# EAGLE design Cursor-Internal (EAGLE 7.4.1)
Cursor Keypad Simple 5 Button cursor keys for use inside an ALPR EC60A/B encoder ring. The cursor keys sit on an board that has to be suspenden by an 3D Printed frame. 4 3.2mm mounting holes are for this.
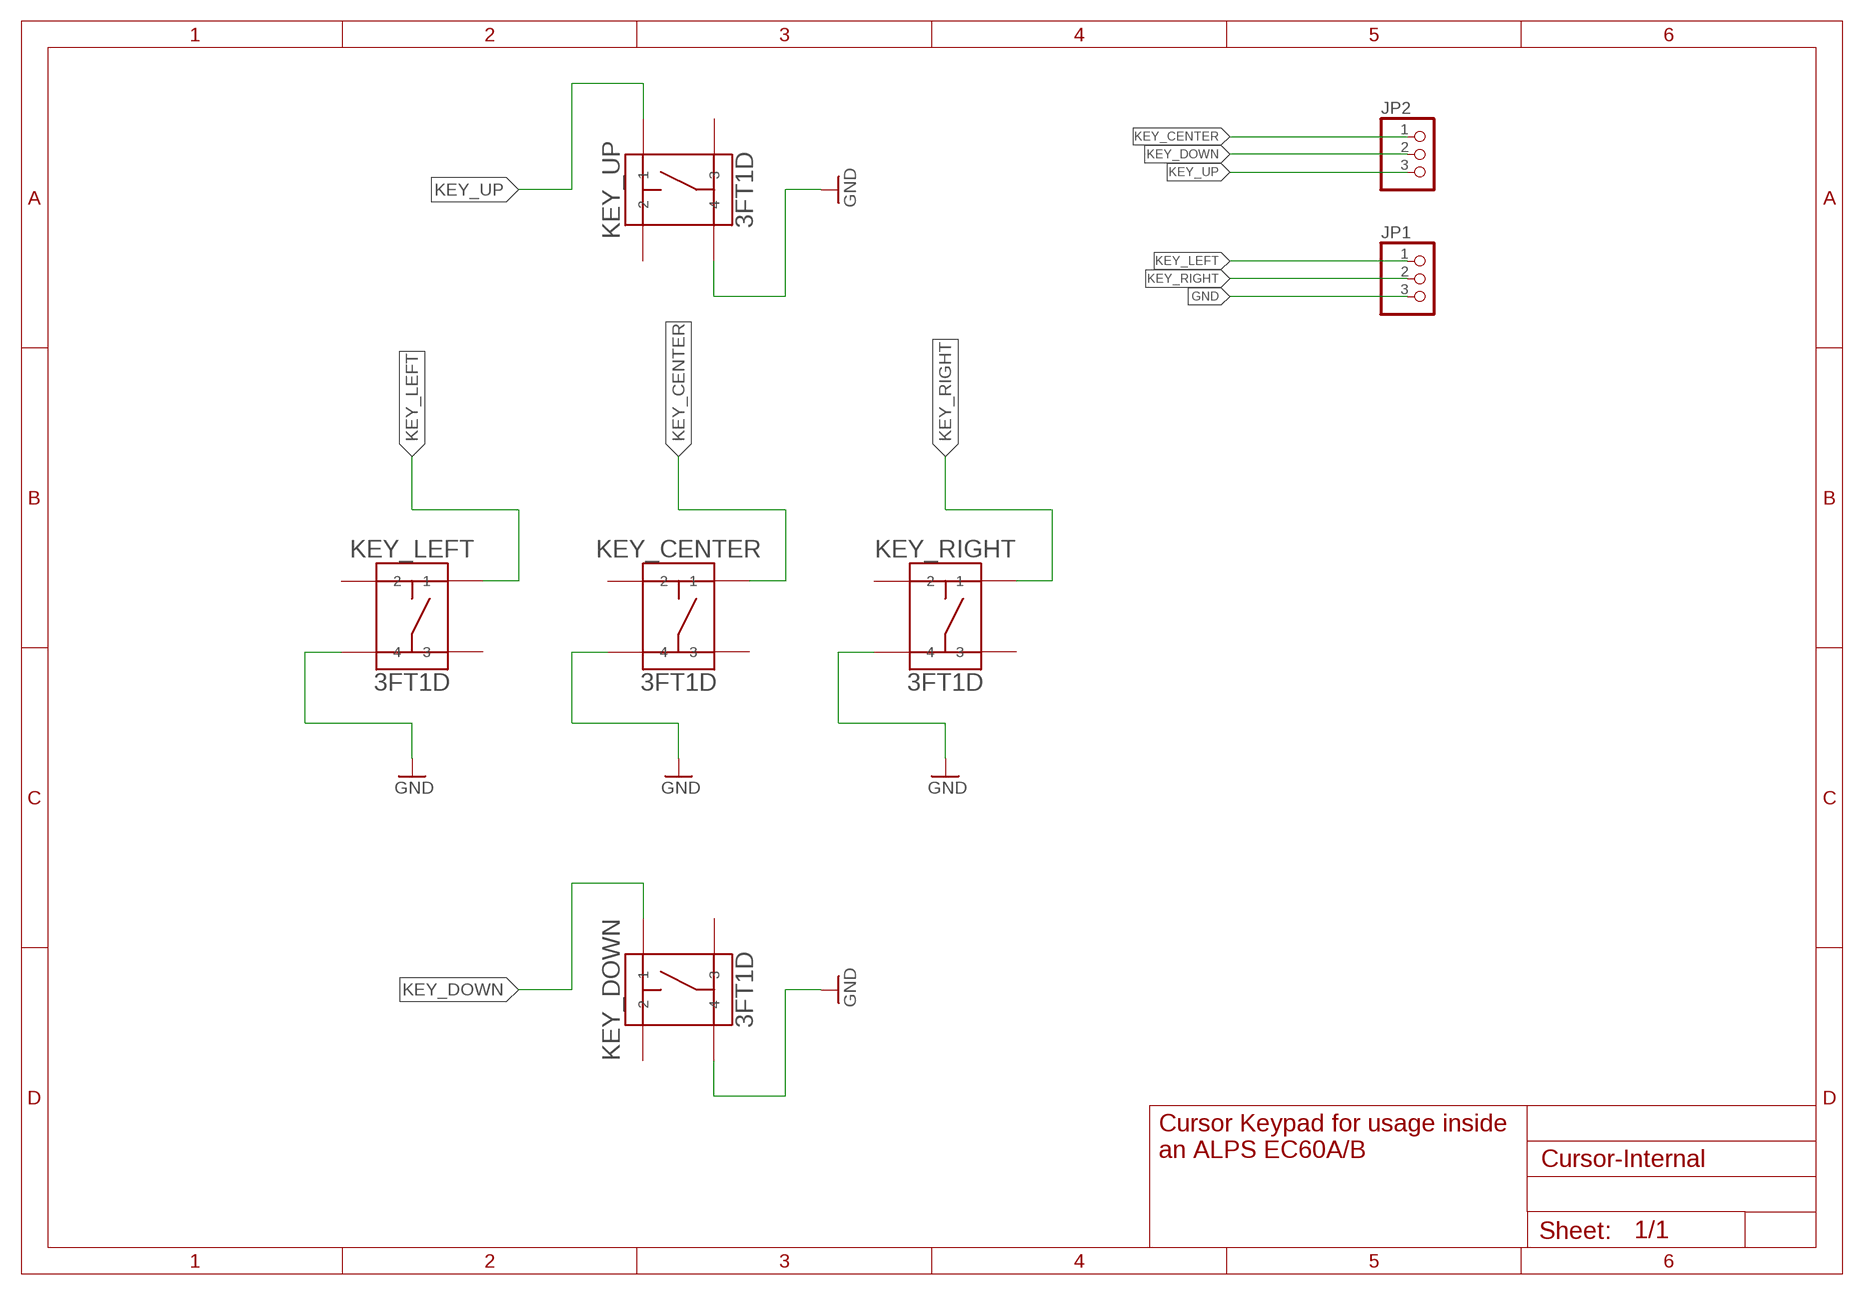
[diagram p0: schematic, sheet 1]

## Parts
JP1  PINHD-1X3  [1X03]
JP2  PINHD-1X3  [1X03]
KEY_CENTER  3FT1D  [3FT]
KEY_DOWN  3FT1D  [3FT]
KEY_LEFT  3FT1D  [3FT]
KEY_RIGHT  3FT1D  [3FT]
KEY_UP  3FT1D  [3FT]

## Nets
GND [Supply]: JP1.3 KEY_CENTER.P$4 KEY_DOWN.P$4 KEY_LEFT.P$4 KEY_RIGHT.P$4 KEY_UP.P$4
KEY_CENTER [Supply]: JP2.1 KEY_CENTER.P$1
KEY_DOWN [Supply]: JP2.2 KEY_DOWN.P$1
KEY_LEFT [Supply]: JP1.1 KEY_LEFT.P$1
KEY_RIGHT [Supply]: JP1.2 KEY_RIGHT.P$1
KEY_UP [Supply]: JP2.3 KEY_UP.P$1
Unconnected: KEY_CENTER.P$2 KEY_CENTER.P$3 KEY_DOWN.P$2 KEY_DOWN.P$3 KEY_LEFT.P$2 KEY_LEFT.P$3 KEY_RIGHT.P$2 KEY_RIGHT.P$3 KEY_UP.P$2 KEY_UP.P$3

## Notes on the sheet
- Cursor Keypad for usage inside
  an ALPS EC60A/B

## Library data of the parts
JP1 JP2 = pinhead:PINHD-1X3: PIN HEADER
KEY_CENTER KEY_DOWN KEY_LEFT KEY_RIGHT KEY_UP = mec switches:3FT1D: Mulitmec - 3FT1D <http://www.mec.dk/statisk.php4?id=504> Switch 3F - Through Hole with basic matt cover http://www.mec.dk

## Net classes
0 default: width 0.3 mm
1 Supply: width 0.762 mm

## Board
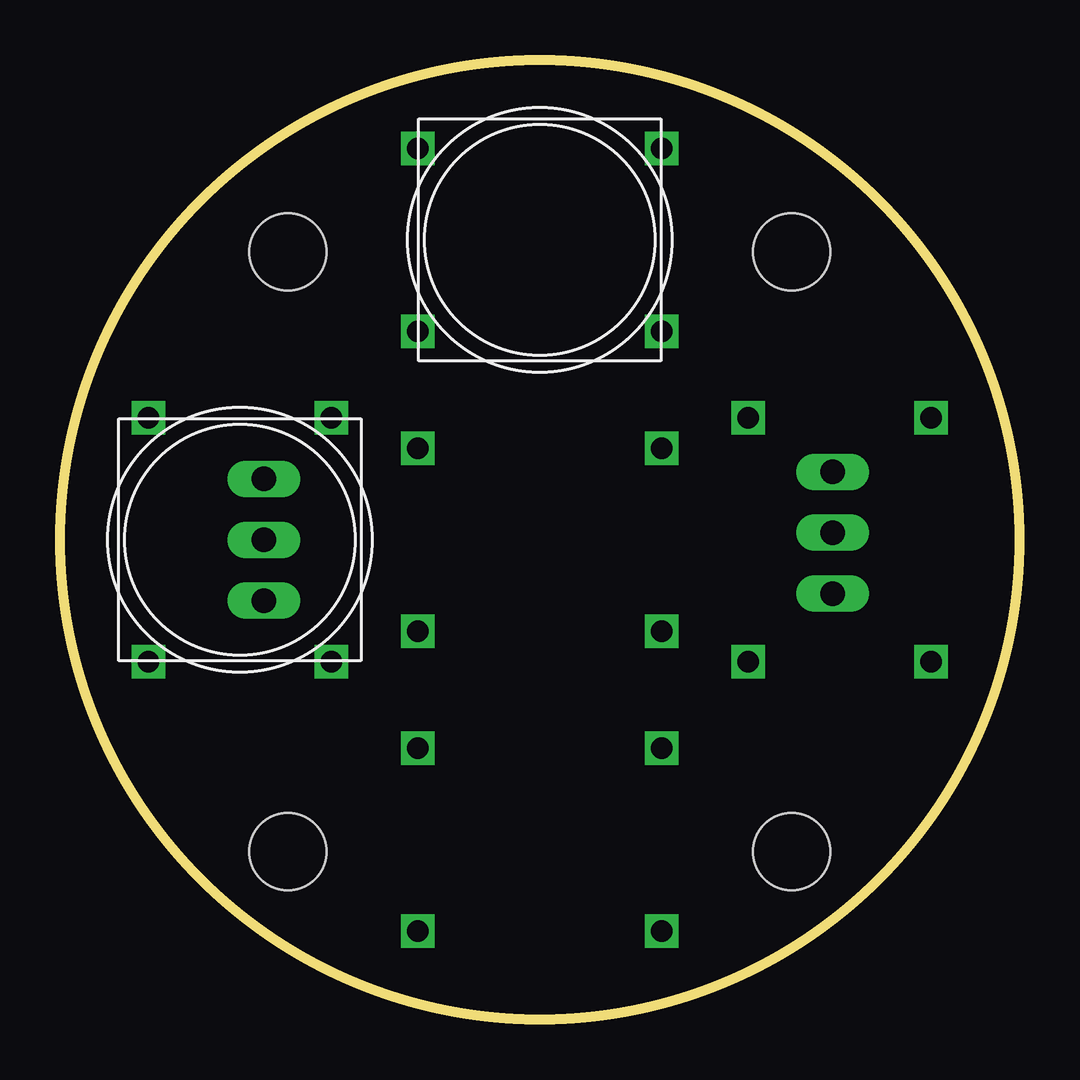
[diagram p1: board, top side]
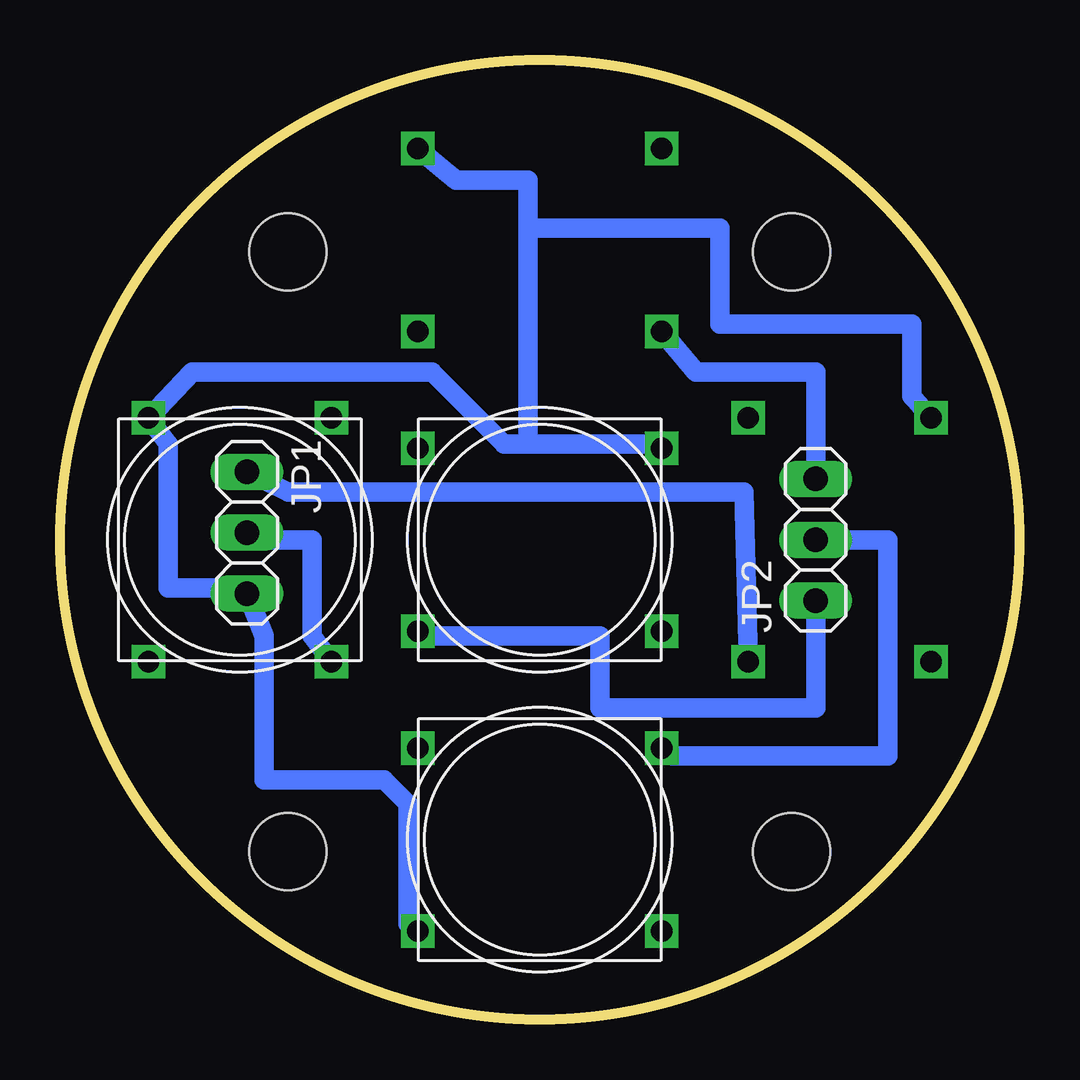
[diagram p2: board, bottom side, seen from below]

Size 40 x 40 mm. Coordinates in mm from the lower left corner, seen from the top.
Outline: circle at 20,20 radius 20
Copper layers (1*16): Top 0.035mm / dielectric 1.5mm / Bottom 0.035mm
Design rules "default": minimum track width 10mil, minimum drill 24mil, track to track 8mil, track to pad 8mil, pad to pad 8mil, via to via 8mil, smd to smd 8mil, copper to edge 40mil, drill to drill 8mil, minimum pad ring 10mil, minimum via ring 8mil, stop-mask expansion 4mil, vias tented up to drill 0mil, thermal gap 10mil
Holes 3.2 mm at 9.5,32 30.5,7 30.5,32 9.5,7

### Footprints (pad centres in the part's own frame; a part is rotated, then mirrored left to right if it is on the bottom)
1X03 = drill 1.016 long: 1 -2.54,0; 2 0,0; 3 2.54,0
3FT = drill 0.9 square: P$1 5.08,3.81; P$2 -5.08,3.81; P$3 5.08,-3.81; P$4 -5.08,-3.81

### Placement (x,y rotation side)
JP1  32.21,20.29 270 bottom
JP2  8.5,20 90 bottom
KEY_CENTER  20,20 180 bottom
KEY_DOWN  20,7.5 0 bottom
KEY_LEFT  7.5,20 270 top
KEY_RIGHT  32.5,20 270 bottom
KEY_UP  20,32.5 180 top

### Tracks (layer width: path | path; a pad name or v marks a point on that pad's centre or on a via)
GND
  Bottom 0.813: KEY_LEFT.P$4 4.5,26 4.5,29 12.5,29 12.5,33 20.5,33 | 20.5,33 20.5,35 23.5,35 KEY_UP.P$4 | KEY_CENTER.P$4 15.5,24 20.5,24 | 20.5,24 20.5,33 | KEY_DOWN.P$4 25.5,4 25.5,9 26.5,10 31.5,10 31.5,16 JP1.3 32.5,18 35.5,18 35.5,24 KEY_RIGHT.P$4 34.5,27 24.5,27 21.5,24 20.5,24
KEY_CENTER
  Bottom 0.813: KEY_CENTER.P$1 24.5,16 17.5,16 17.5,13 8.5,13 JP2.1
KEY_DOWN
  Bottom 0.813: KEY_DOWN.P$1 14.5,11 5.5,11 5.5,20 JP2.2
KEY_LEFT
  Bottom 0.813: KEY_LEFT.P$1 11.5,22 30.5,22 JP1.1
KEY_RIGHT
  Bottom 0.813: JP1.2 31.5,20 29.5,20 29.5,16 KEY_RIGHT.P$1
KEY_UP
  Bottom 0.813: KEY_UP.P$1 13.5,27 8.5,27 JP2.3